# Altium project simController.PrjPcb
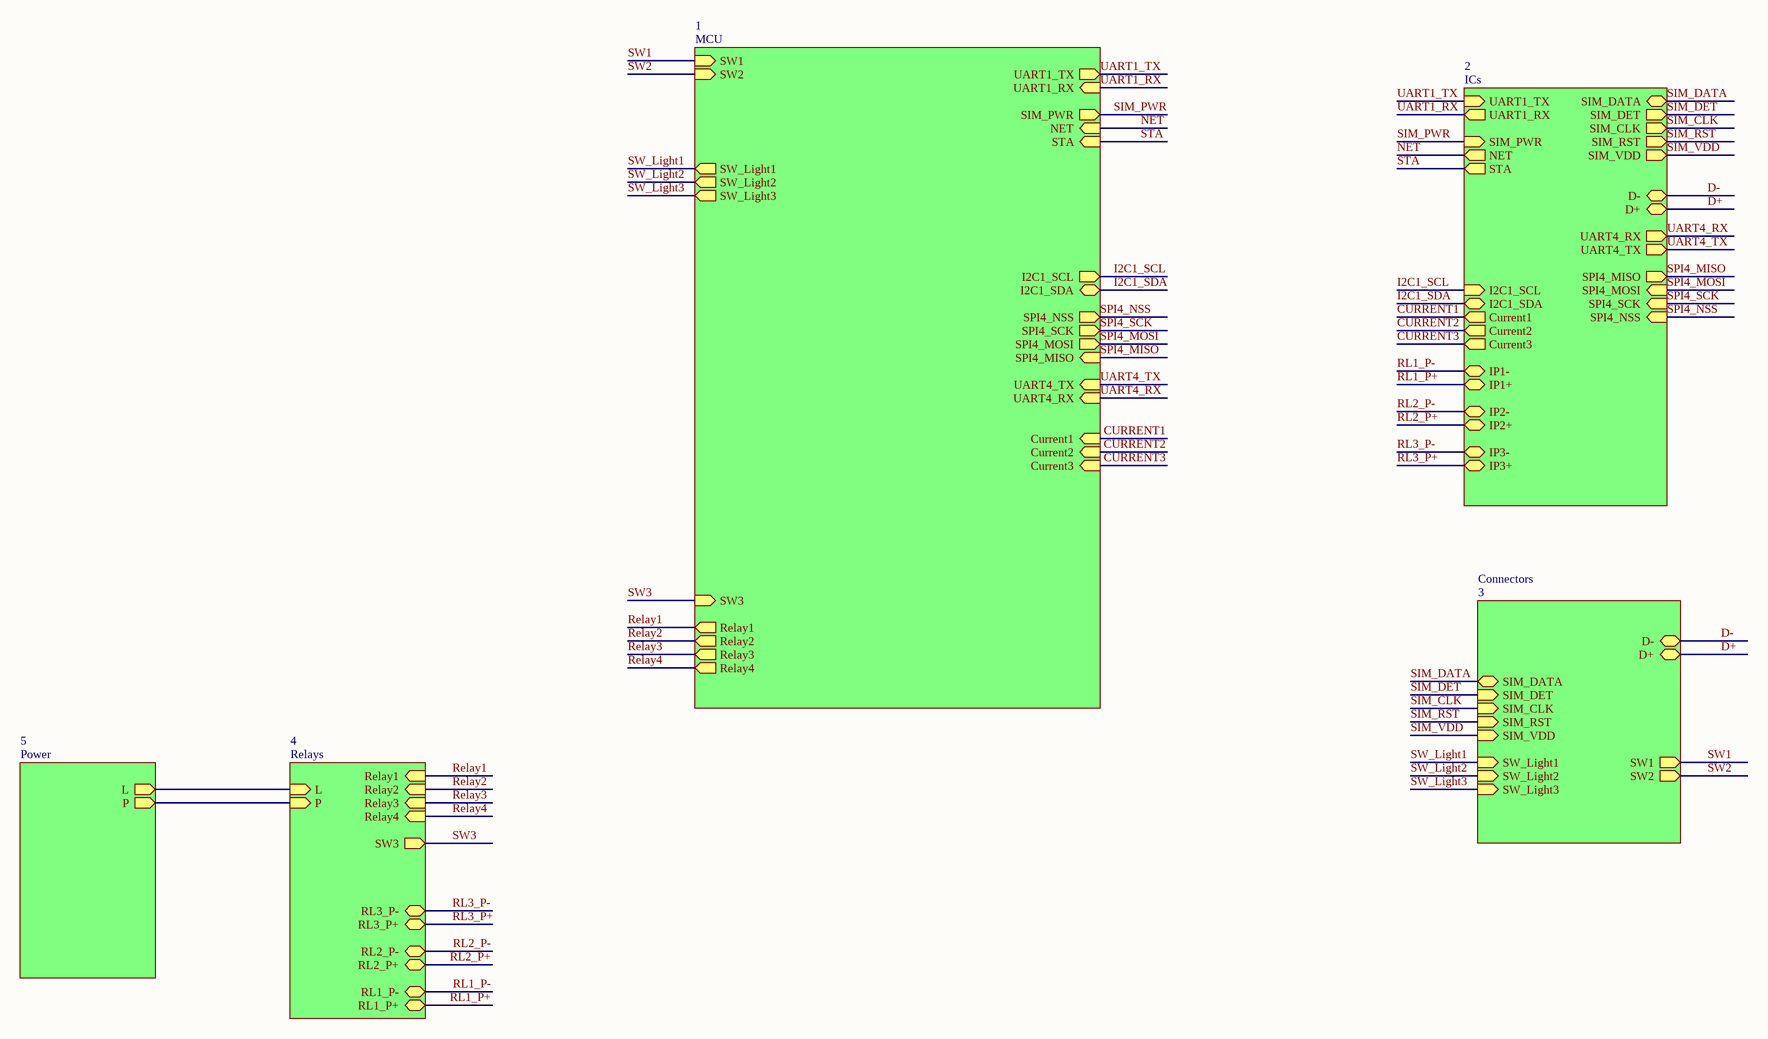
[diagram p0: Main.SchDoc]
6 sheets, 165 parts. Net scope: hierarchical (ports join the sheet entries above them; power ports are global).
Board file: SIM_Cntroller_P200.PcbDoc
Sheets:
  Main.SchDoc
    1 = MCU.SchDoc
    4 = Relays.SchDoc
    3 = Connectors.SchDoc
    5 = Power.SchDoc
    2 = ICs.SchDoc

## Sheet Main.SchDoc
size A3

### Sub-sheets
1 = MCU: Relay1 (out), Relay2 (out), UART4_RX (in), UART1_TX (out), UART1_RX (in), SIM_PWR (out), NET (in), STA (in), I2C1_SCL (out), I2C1_SDA (bidir), SPI4_NSS (out), SPI4_SCK (out), SPI4_MOSI (out), SPI4_MISO (in), SW1 (in), SW2 (in), SW_Light1 (out), SW_Light2 (out), Current1 (in), Current2 (in), SW_Light3 (out), UART4_TX (in), Relay3 (out), Relay4 (out), SW3 (in), Current3 (in)
2 = ICs: STA (out), NET (out), SIM_PWR (in), UART1_RX (out), UART1_TX (in), I2C1_SCL (in), I2C1_SDA (bidir), SPI4_NSS (in), SPI4_SCK (in), SPI4_MOSI (in), SPI4_MISO (out), UART4_RX (out), D+ (bidir), D- (bidir), SIM_CLK (out), SIM_DATA (bidir), SIM_DET (out), SIM_RST (out), SIM_VDD (out), IP2- (bidir), IP2+ (bidir), IP1- (bidir), IP1+ (bidir), Current1 (out), Current2 (out), UART4_TX (out), IP3- (bidir), IP3+ (bidir), Current3 (out)
3 = Connectors: SW_Light1 (in), SW_Light2 (in), D- (bidir), D+ (bidir), SW1 (out), SW2 (out), SIM_DATA (bidir), SIM_DET (in), SIM_CLK (in), SIM_RST (in), SIM_VDD (in), SW_Light3 (in)
4 = Relays: Relay1 (in), Relay2 (in), L (in), P (in), RL1_P- (bidir), RL1_P+ (bidir), RL2_P- (bidir), RL2_P+ (bidir), Relay3 (in), RL3_P+ (bidir), Relay4 (in), RL3_P- (bidir), SW3 (out)
5 = Power: L (out), P (out)

### Nets
CURRENT1: sheet 1/Current1, sheet 2/Current1
CURRENT2: sheet 1/Current2, sheet 2/Current2
CURRENT3: sheet 1/Current3, sheet 2/Current3
D+: sheet 3/D+, sheet 2/D+
D-: sheet 3/D-, sheet 2/D-
I2C1_SCL: sheet 1/I2C1_SCL, sheet 2/I2C1_SCL
I2C1_SDA: sheet 1/I2C1_SDA, sheet 2/I2C1_SDA
L: sheet 4/L, sheet 5/L
NET: sheet 1/NET, sheet 2/NET
P: sheet 4/P, sheet 5/P
Relay1: sheet 1/Relay1, sheet 4/Relay1
Relay2: sheet 1/Relay2, sheet 4/Relay2
Relay3: sheet 1/Relay3, sheet 4/Relay3
Relay4: sheet 1/Relay4, sheet 4/Relay4
RL1_P+: sheet 4/RL1_P+, sheet 2/IP1+
RL1_P-: sheet 4/RL1_P-, sheet 2/IP1-
RL2_P+: sheet 4/RL2_P+, sheet 2/IP2+
RL2_P-: sheet 4/RL2_P-, sheet 2/IP2-
RL3_P+: sheet 4/RL3_P+, sheet 2/IP3+
RL3_P-: sheet 4/RL3_P-, sheet 2/IP3-
SIM_CLK: sheet 3/SIM_CLK, sheet 2/SIM_CLK
SIM_DATA: sheet 3/SIM_DATA, sheet 2/SIM_DATA
SIM_DET: sheet 3/SIM_DET, sheet 2/SIM_DET
SIM_PWR: sheet 1/SIM_PWR, sheet 2/SIM_PWR  [project net PWRKEY]
SIM_RST: sheet 3/SIM_RST, sheet 2/SIM_RST
SIM_VDD: sheet 3/SIM_VDD, sheet 2/SIM_VDD
SPI4_MISO: sheet 1/SPI4_MISO, sheet 2/SPI4_MISO
SPI4_MOSI: sheet 1/SPI4_MOSI, sheet 2/SPI4_MOSI
SPI4_NSS: sheet 1/SPI4_NSS, sheet 2/SPI4_NSS
SPI4_SCK: sheet 1/SPI4_SCK, sheet 2/SPI4_SCK
STA: sheet 1/STA, sheet 2/STA
SW1: sheet 1/SW1, sheet 3/SW1
SW2: sheet 1/SW2, sheet 3/SW2
SW3: sheet 1/SW3, sheet 4/SW3
SW_Light1: sheet 1/SW_Light1, sheet 3/SW_Light1
SW_Light2: sheet 1/SW_Light2, sheet 3/SW_Light2
SW_Light3: sheet 1/SW_Light3, sheet 3/SW_Light3
UART1_RX: sheet 1/UART1_RX, sheet 2/UART1_RX  [project net sim800_tx]
UART1_TX: sheet 1/UART1_TX, sheet 2/UART1_TX  [project net sim800_rx]
UART4_RX: sheet 1/UART4_RX, sheet 2/UART4_RX  [project net ESP_RXD]
UART4_TX: sheet 1/UART4_TX, sheet 2/UART4_TX  [project net ESP_TXD]

## Sheet MCU.SchDoc
size A3
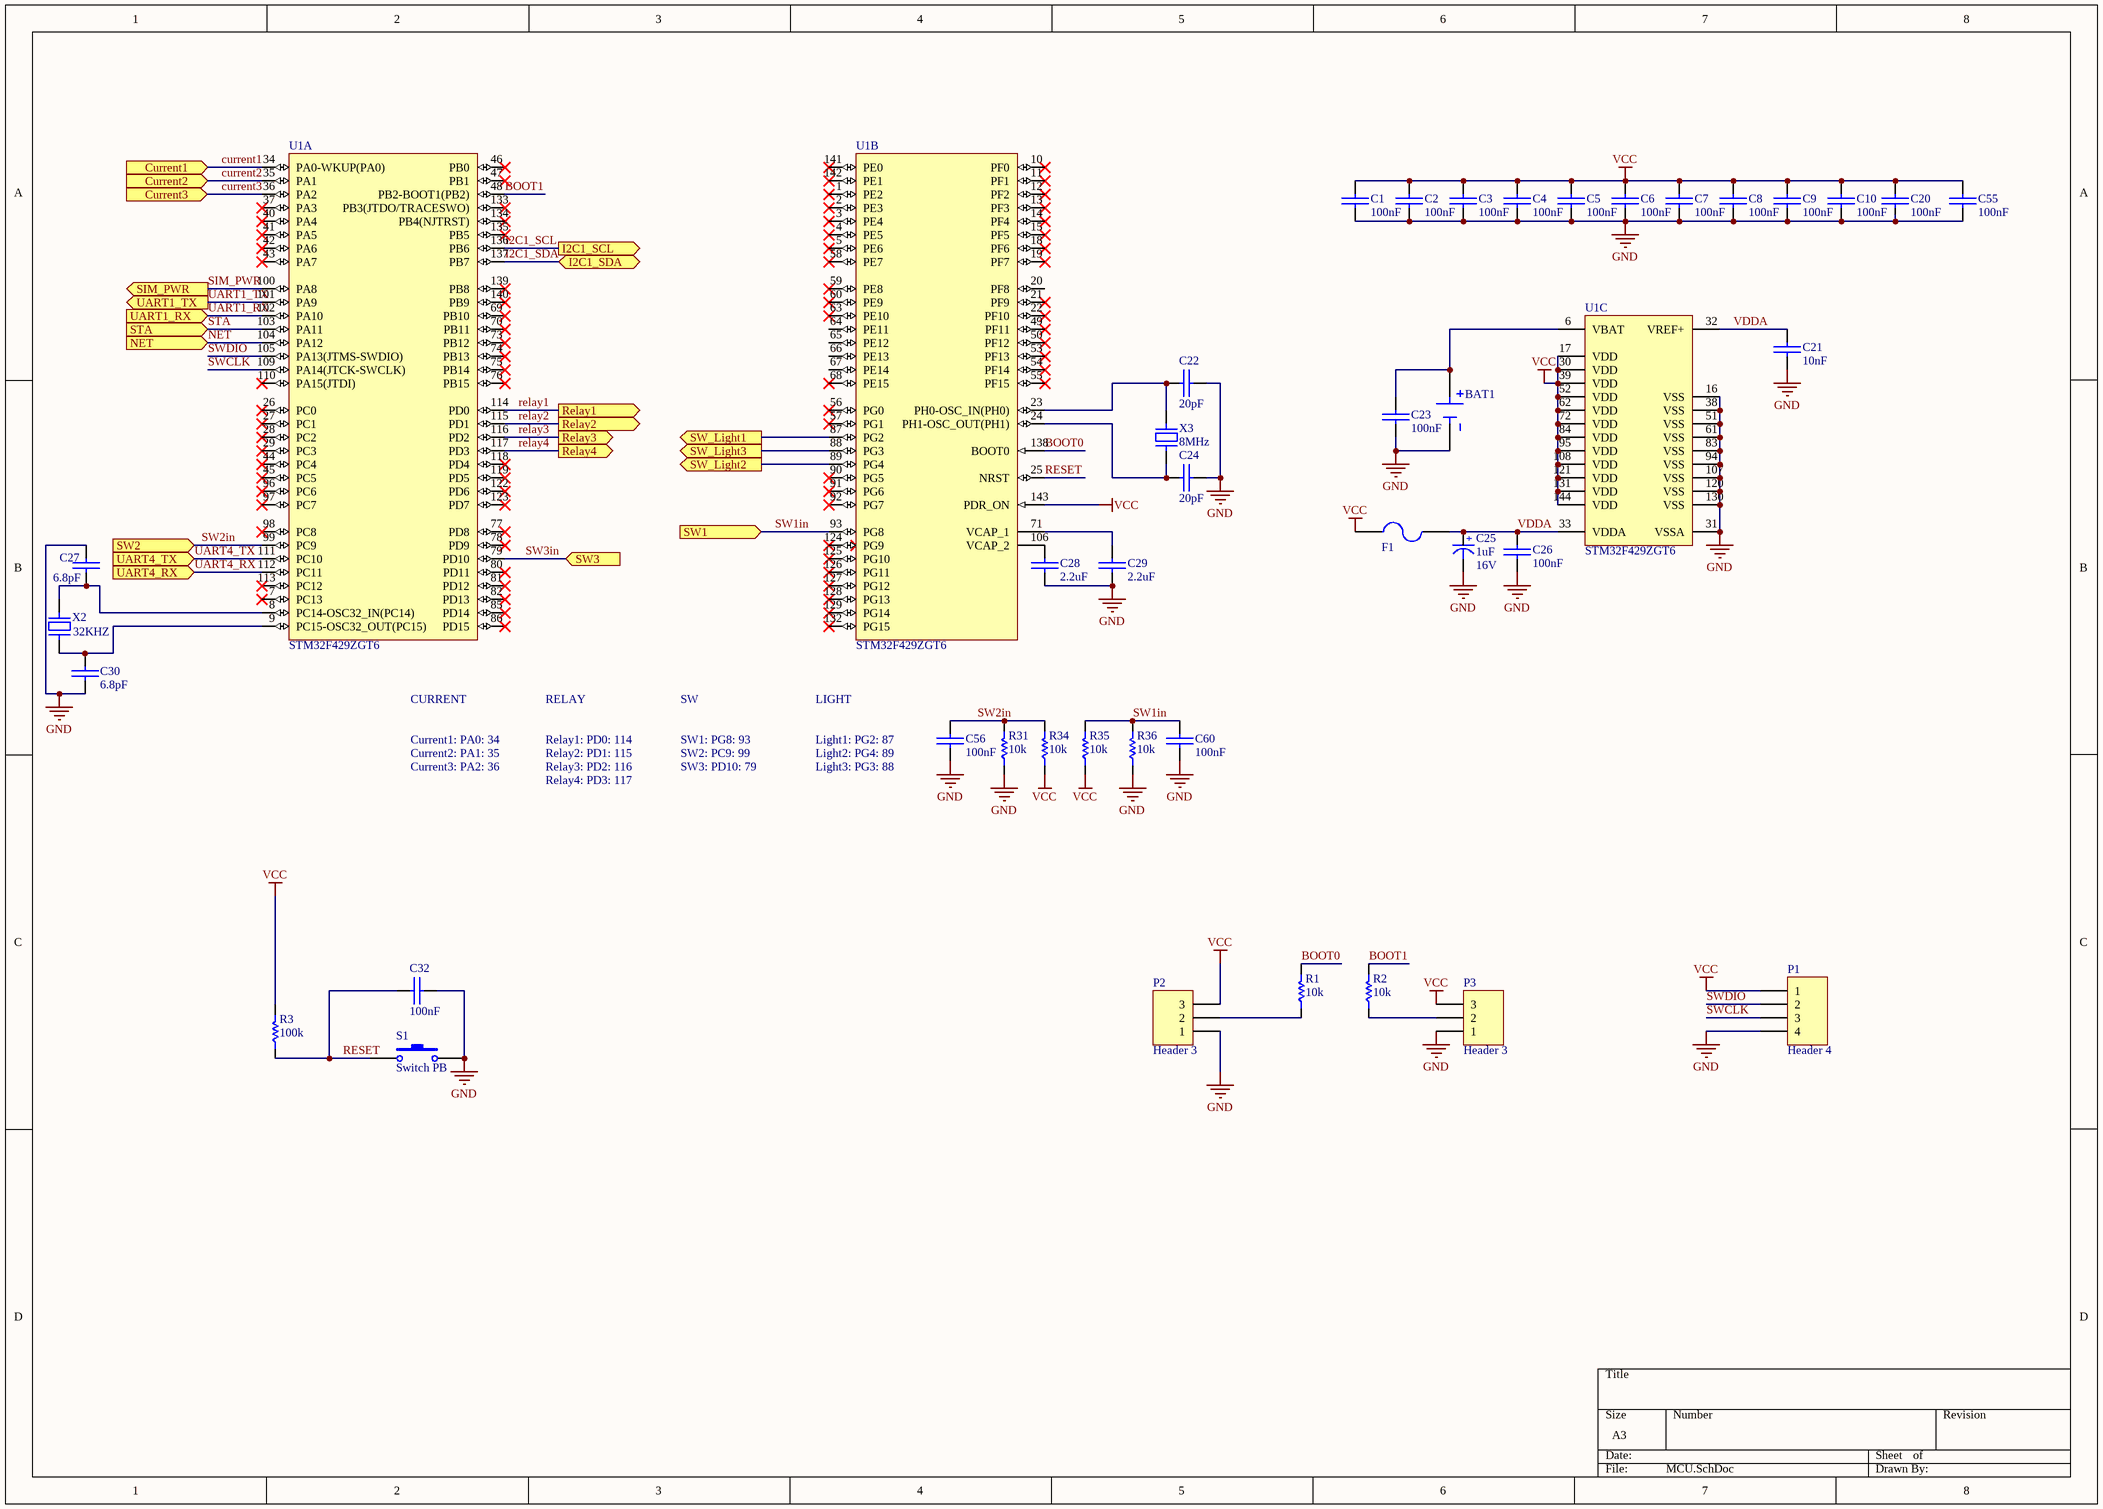
[diagram p1: MCU.SchDoc]

### Parts
BAT1  BAT  [BAT_STAND]  (value not drawn)
C1  100nF  [CAP 0603_1608]
C2  100nF  [CAP 0603_1608]
C3  100nF  [CAP 0603_1608]
C4  100nF  [CAP 0603_1608]
C5  100nF  [CAP 0603_1608]
C6  100nF  [CAP 0603_1608]
C7  100nF  [CAP 0603_1608]
C8  100nF  [CAP 0603_1608]
C9  100nF  [CAP 0603_1608]
C10  100nF  [CAP 0603_1608]
C20  100nF  [CAP 0603_1608]
C21  10nF  [CAP 0603_1608]
C22  20pF  [CAP 0805_2012]
C23  100nF  [CAP 0603_1608]
C24  20pF  [CAP 0805_2012]
C25  Voltage: 16V  [CAPP 1206 (3216X18L) Size A]  (hidden comment: 1uF)
C26  100nF  [CAP 0603_1608]
C27  6.8pF  [CAP 0805_2012]
C28  2.2uF  [CAP 0805_2012]
C29  2.2uF  [CAP 0805_2012]
C30  6.8pF  [CAP 0805_2012]
C32  100nF  [CAP 0603_1608]
C55  100nF  [CAP 0603_1608]
C56  100nF  [CAP 0805_2012]
C60  100nF  [CAP 0805_2012]
F1  Ferrite Bead  [FUSE_0805]  (value not drawn)
P1  Header 4  [HDR1X4]
P2  Header 3  [HDR1X3]
P3  Header 3  [HDR1X3]
R1  10k  [RES 0805_2012]
R2  10k  [RES 0805_2012]
R3  100k  [RES 0805_2012]
R31  10k  [RES 0805_2012]
R34  10k  [RES 0805_2012]
R35  10k  [RES 0805_2012]
R36  10k  [RES 0805_2012]
S1  Switch PB  [Switch - Push to On]
U1  STM32F429ZGT6  [LQFP144]  (parts A,B,C of 3)
X2  32KHZ  [IND 1206_3216]
X3  Parameter 1: 8MHz  [XTAL THD HC49]

### Ports
Current1 (in), Current2 (in), Current3 (in), I2C1_SCL (out), I2C1_SDA (bidir), NET (in), Relay1 (out), Relay2 (out), Relay3 (out), Relay4 (out), SIM_PWR (out), STA (in), SW1 (in), SW2 (in), SW3 (in), SW_Light1 (out), SW_Light2 (out), SW_Light3 (out), UART1_RX (in), UART1_TX (out), UART4_RX (in), UART4_TX (in)

### Nets
GND: BAT1.NEG C1.1(+) C2.1(+) C3.1(+) C4.1(+) C5.1(+) C6.1(+) C7.1(+) C8.1(+) C9.1(+) C10.1(+) C20.1(+) C21.1(+) C22.1(+) C23.1(+) C24.1(+) C25.2(-) C26.1(+) C27.1(+) C28.1(+) C29.1(+) C30.2(-) C32.1(+) C55.1(+) C56.1(+) C60.1(+) P1.4 P2.1 P3.1 R31.1 R36.1 S1.2 U1.16(VSS) U1.31(VSSA) U1.38(VSS) U1.51(VSS) U1.61(VSS) U1.83(VSS) U1.94(VSS) U1.107(VSS) U1.120(VSS) U1.130(VSS)
VCC: C1.2(-) C2.2(-) C3.2(-) C4.2(-) C5.2(-) C6.2(-) C7.2(-) C8.2(-) C9.2(-) C10.2(-) C20.2(-) C55.2(-) F1.1 P1.1 P2.3 P3.3 R3.2 R34.1 R35.1 U1.17(VDD) U1.30(VDD) U1.39(VDD) U1.52(VDD) U1.62(VDD) U1.72(VDD) U1.84(VDD) U1.95(VDD) U1.108(VDD) U1.121(VDD) U1.131(VDD) U1.143(PDR_ON) U1.144(VDD)
BOOT0: R1.2 U1.138(BOOT0)
BOOT1: R2.2 U1.48(PB2-BOOT1(PB2))
CURRENT1: U1.34(PA0-WKUP(PA0)) ; port Current1
CURRENT2: U1.35(PA1) ; port Current2
CURRENT3: U1.36(PA2) ; port Current3
I2C1_SCL: U1.136(PB6) ; port I2C1_SCL
I2C1_SDA: U1.137(PB7) ; port I2C1_SDA
NET: U1.104(PA12) ; port NET
Relay1: U1.114(PD0) ; port Relay1
Relay2: U1.115(PD1) ; port Relay2
Relay3: U1.116(PD2) ; port Relay3
Relay4: U1.117(PD3) ; port Relay4
RESET: C32.2(-) R3.1 S1.1 U1.25(NRST)
SIM_PWR: U1.100(PA8) ; port SIM_PWR  [project net PWRKEY]
STA: U1.103(PA11) ; port STA
SW1in: C60.2(-) R35.2 R36.2 U1.93(PG8) ; port SW1  [project net SW1]
SW2in: C56.2(-) R31.2 R34.2 U1.99(PC9) ; port SW2  [project net SW2]
SW3in: U1.79(PD10) ; port SW3  [project net SW3]
SW_Light1: U1.87(PG2) ; port SW_Light1
SW_Light2: U1.89(PG4) ; port SW_Light2
SW_Light3: U1.88(PG3) ; port SW_Light3
SWCLK: P1.3 U1.109(PA14(JTCK-SWCLK))
SWDIO: P1.2 U1.105(PA13(JTMS-SWDIO))
UART1_RX: U1.102(PA10) ; port UART1_RX  [project net sim800_tx]
UART1_TX: U1.101(PA9) ; port UART1_TX  [project net sim800_rx]
UART4_RX: U1.112(PC11) ; port UART4_RX  [project net ESP_RXD]
UART4_TX: U1.111(PC10) ; port UART4_TX  [project net ESP_TXD]
VDDA: C21.2(-) C25.1(+) C26.2(-) F1.2 U1.32(VREF+) U1.33(VDDA)
NetBAT1_S+1: BAT1.S+1(POS) BAT1.S+2(POS) C23.2(-) U1.6(VBAT)
NetC22_2: C22.2(-) U1.23(PH0-OSC_IN(PH0)) X3.2
NetC24_2: C24.2(-) U1.24(PH1-OSC_OUT(PH1)) X3.1
NetC27_2: C27.2(-) U1.8(PC14-OSC32_IN(PC14)) X2.2
NetC28_2: C28.2(-) U1.106(VCAP_2)
NetC29_2: C29.2(-) U1.71(VCAP_1)
NetC30_1: C30.1(+) U1.9(PC15-OSC32_OUT(PC15)) X2.1
NetP2_2: P2.2 R1.1
NetP3_2: P3.2 R2.1

Not connected (* = marked no-connect by the designer): U1 1(PE2)* 2(PE3)* 3(PE4)* 4(PE5)* 5(PE6)* 7(PC13)* 10(PF0)* 11(PF1)* 12(PF2)* 13(PF3)* 14(PF4)* 15(PF5)* 18(PF6)* 19(PF7)* 20(PF8) 21(PF9)* 22(PF10)* 26(PC0)* 27(PC1)* 28(PC2)* 29(PC3)* 37(PA3)* 40(PA4)* 41(PA5)* 42(PA6)* 43(PA7)* 44(PC4)* 45(PC5)* 46(PB0)* 47(PB1)* 49(PF11)* 50(PF12)* 53(PF13)* 54(PF14)* 55(PF15)* 56(PG0)* 57(PG1)* 58(PE7)* 59(PE8)* 60(PE9)* 63(PE10)* 64(PE11) 65(PE12) 66(PE13) 67(PE14) 68(PE15)* 69(PB10)* 70(PB11)* 73(PB12)* 74(PB13)* 75(PB14)* 76(PB15)* 77(PD8)* 78(PD9)* 80(PD11)* 81(PD12)* 82(PD13)* 85(PD14)* 86(PD15)* 90(PG5)* 91(PG6)* 92(PG7)* 96(PC6)* 97(PC7)* 98(PC8)* 110(PA15(JTDI))* 113(PC12)* 118(PD4)* 119(PD5)* 122(PD6)* 123(PD7)* 124(PG9)* 125(PG10)* 126(PG11)* 127(PG12)* 128(PG13)* 129(PG14)* 132(PG15)* 133(PB3(JTDO/TRACESWO))* 134(PB4(NJTRST))* 135(PB5)* 139(PB8)* 140(PB9)* 141(PE0)* 142(PE1)*

### Notes on the sheet
- CURRENT
- RELAY
- SW
- LIGHT
- Current1: PA0: 34
- Current2: PA1: 35
- Current3: PA2: 36
- Relay1: PD0: 114
- Relay2: PD1: 115
- Relay3: PD2: 116
- Relay4: PD3: 117
- SW3: PD10: 79
- SW1: PG8: 93
- SW2: PC9: 99
- (near C56) Light2: PG4: 89
- (near C56) Light3: PG3: 88
- (near C56) Light1: PG2: 87

### Library data of the parts
BAT1 = BAT: BATTERY HOLDER COIN
C1-C10 C20-C24 C26-C30 C32 C55 C56 C60 = Cap-Bipolar: Bipolar Capacitor; Voltage: 100V; Designer: Saeid Jorablo; Organazation: ControTec; Adding Date: 1387/12/20
  C1-C10 C20 C23 C26 C32 C55 C56 C60: Value: 100nF
  C21: Value: 10nF
  C22 C24: Value: 20pF
  C27 C30: Value: 6.8pF
  C28 C29: Value: 2.2uF
C25 = Cap-Polar: Polar Capacitor; Designer: Saeid Jorablo; Organazation: ControTec; Adding Date: 1387/12/20; Value: 1uF
F1 = Fuse 0805: Value: Ferrite Bead
P1 = Header 4: Header, 4-Pin; LatestRevisionDate: 17-Jul-2002; LatestRevisionNote: Re-released for DXP Platform.; Publisher: Altium Limited
P2 P3 = Header 3: Header, 3-Pin; LatestRevisionDate: 17-Jul-2002; LatestRevisionNote: Re-released for DXP Platform.; Publisher: Altium Limited
R1-R3 R31 R34-R36 = Resistor
  R1 R2 R31 R34-R36: Value: 10k
  R3: Value: 100k
S1 = Switch PB: Push Button Switch
U1 = STM32F429ZGT6: ARM Cortex-M4 32-bit MCU+FPU, 225 DMIPS, 1024 kB Flash, 256 kB Internal RAM, 114 I/Os, 144-pin LQFP, -40 to 85 degC, Tray; Manufacturer: STMicroelectronics; D/A Converter: 2x12-bit; FLASH Size (Prog) (kB): 1024; I/Os (High Current): 114; Internal RAM Size (kB): 256; Operating Frequency(F) (Processor speed) (MHz): 180; Supply Voltage(Vcc) max (V): 3.6; Supply Voltage(Vcc) min (V): 1.8; DatasheetVersion: Rev. 2; PackageVersion: Rev. 4, 06/2013; PackageReference: LQFP144; PackageDescription: 144-Pin Low Profile Quad Flat Package, 20 x 20 mm Body, 0.5 mm Pitch; Core: ARM Cortex-M4; Packing: Tray; Mounting Technology: Surface Mount; PartNumber: STM32F429ZGT6; ComponentLink1Description: Manufacturer URL; ComponentLink1URL: http://www.st.com/web/en/home.html; ComponentLink2Description: Datasheet; ComponentLink2URL: http://www.st.com/st-web-ui/static/active/en/resource/technical/document/data_brief/DM00053488.pdf; ComponentLink3Description: Package Specification; ComponentLink3URL: http://www.st.com/st-web-ui/static/active/en/resource/technical/document/datasheet/DM00037051.pdf
X2 = Crystal HC-49S SMD: SMT Crystal; VALUE: 32KHZ
X3 = Crystal THD HC49: SMT Crystal

## Sheet Relays.SchDoc
size A3
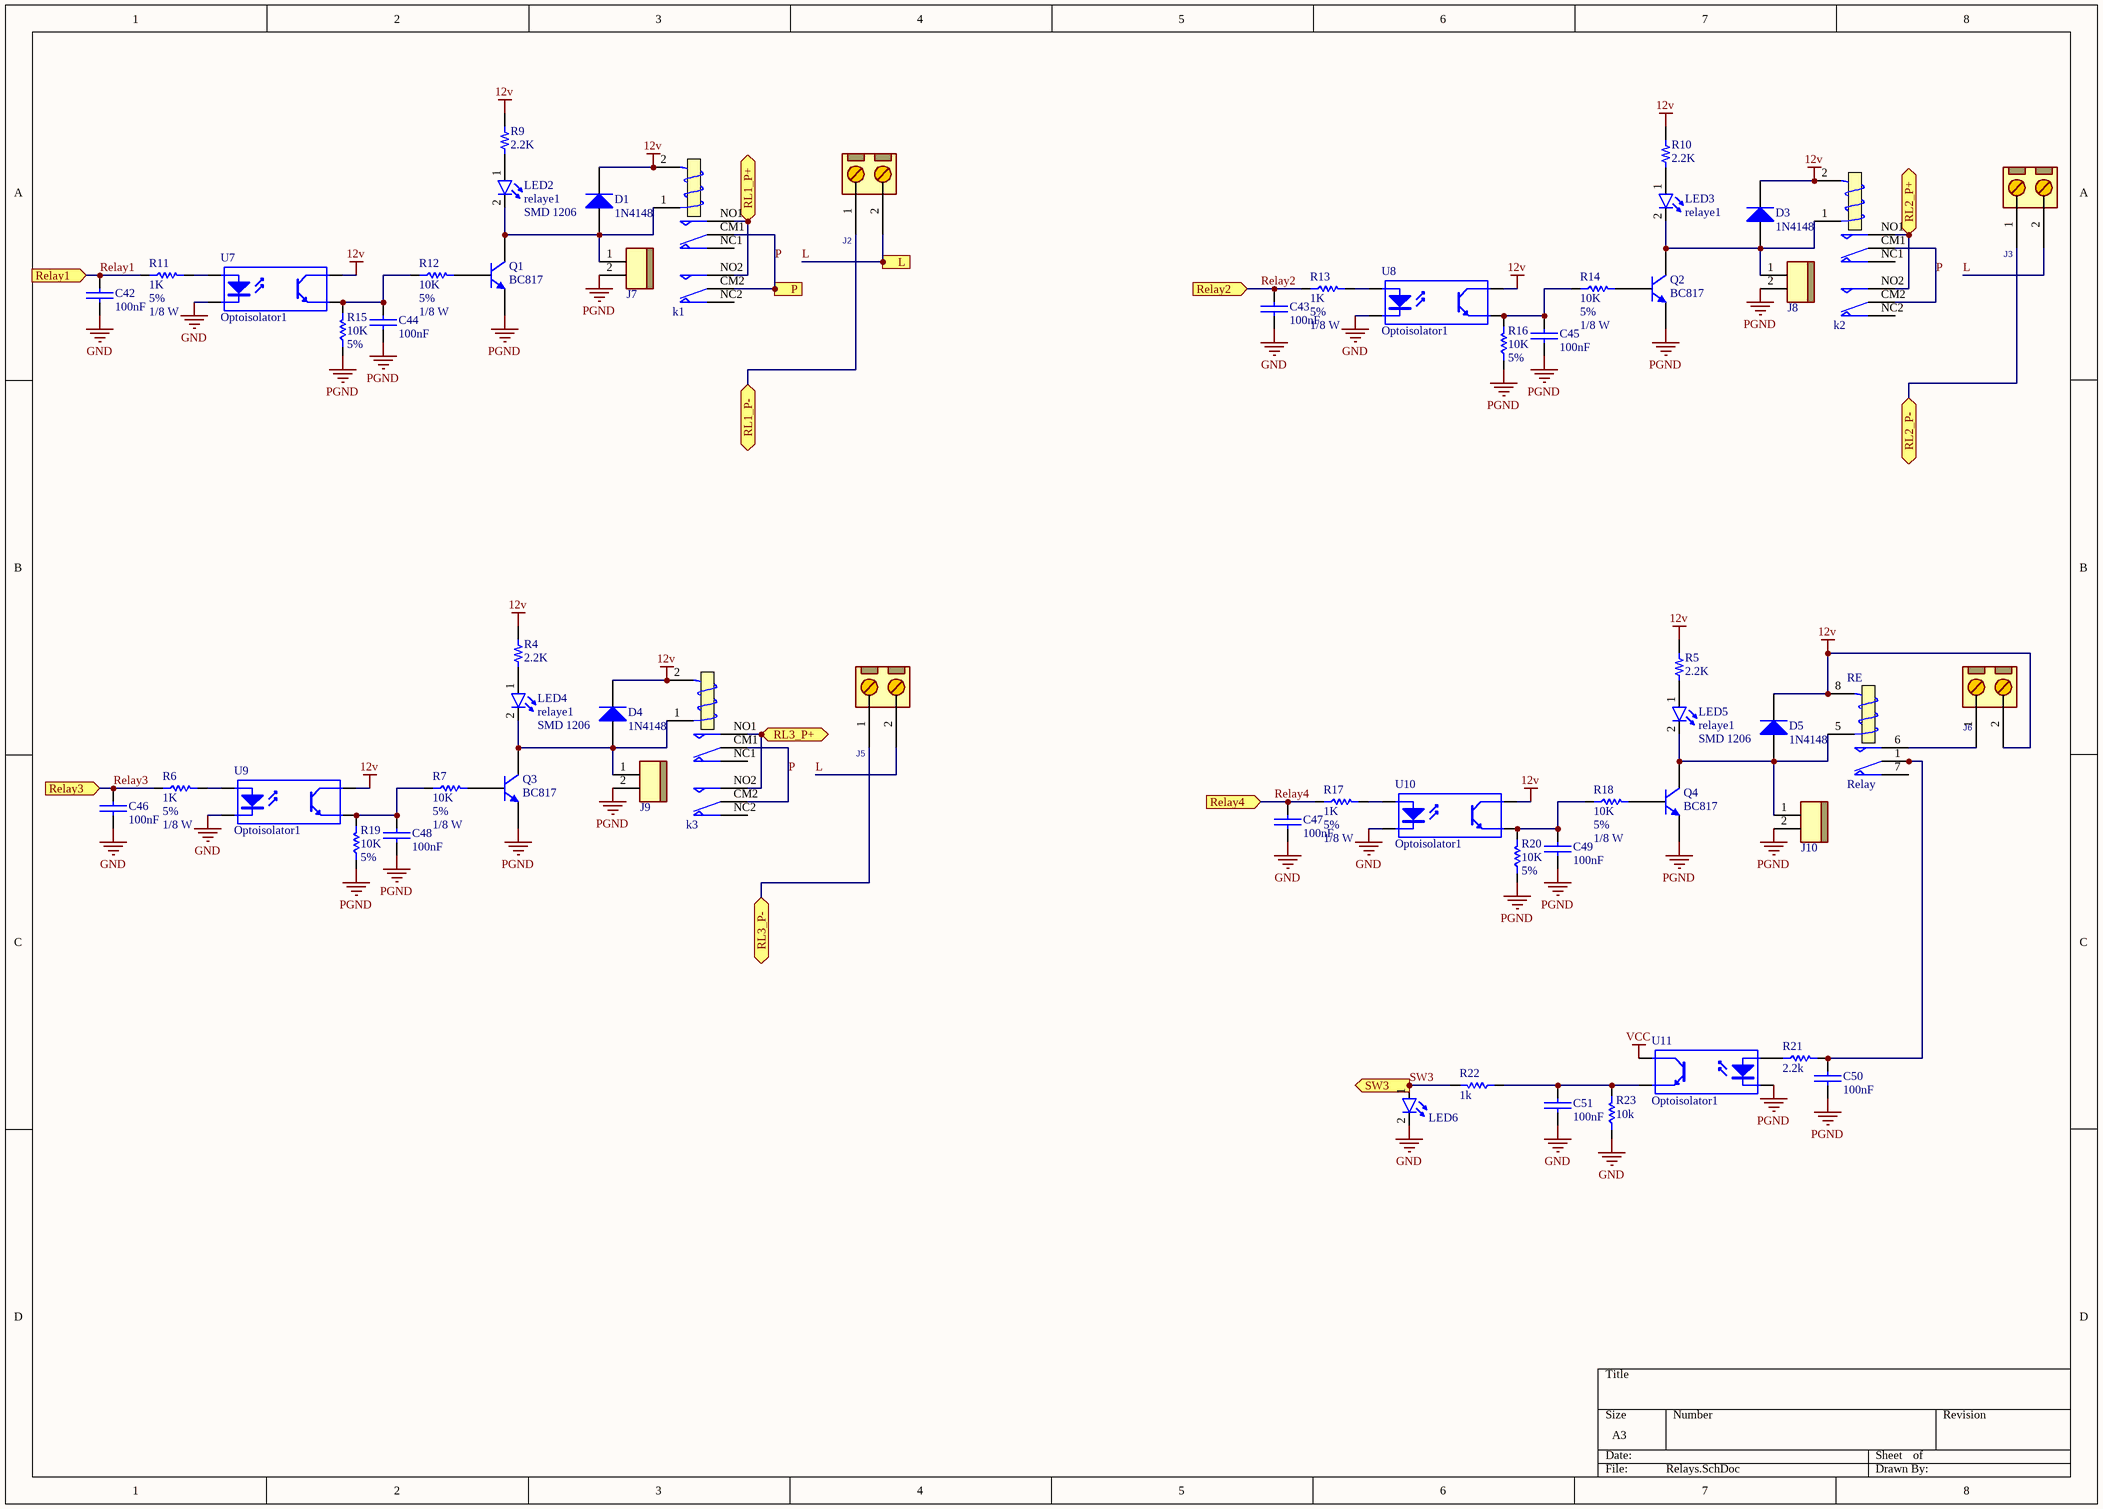
[diagram p2: Relays.SchDoc]

### Parts
C42  100nF  [CAP 0805_2012]
C43  100nF  [CAP 0805_2012]
C44  100nF  [CAP 0805_2012]
C45  100nF  [CAP 0805_2012]
C46  100nF  [CAP 0805_2012]
C47  100nF  [CAP 0805_2012]
C48  100nF  [CAP 0805_2012]
C49  100nF  [CAP 0805_2012]
C50  100nF  [CAP 0805_2012]
C51  100nF  [CAP 0805_2012]
D1  1N4148  [LL4148]
D3  1N4148  [LL4148]
D4  1N4148  [LL4148]
D5  1N4148  [LL4148]
J2  CONN_TB2  [P_TBB_2]  (value not drawn)
J3  CONN_TB2  [P_TBB_2]  (value not drawn)
J5  CONN_TB2  [P_TBB_2]  (value not drawn)
J6  CONN_TB2  [P_TBB_2]  (value not drawn)
J7  JST BxB-PH-K 2Pin  [JST B2B-PH-K]  (value not drawn)
J8  JST BxB-PH-K 2Pin  [JST B2B-PH-K]  (value not drawn)
J9  JST BxB-PH-K 2Pin  [JST B2B-PH-K]  (value not drawn)
J10  JST BxB-PH-K 2Pin  [JST B2B-PH-K]  (value not drawn)
k1  Relay_8PIN_OMRON  [Relay_8]  (value not drawn)
k2  Relay_8PIN_OMRON  [Relay_8]  (value not drawn)
k3  Relay_8PIN_OMRON  [Relay_8]  (value not drawn)
LED2  power: relaye1  Size: SMD 1206  [LED SMD 1206]
LED3  power: relaye1  [LED SMD 1206]
LED4  power: relaye1  Size: SMD 1206  [LED SMD 1206]
LED5  power: relaye1  Size: SMD 1206  [LED SMD 1206]
LED6  (no value)  [LED_1206_GREEN]
Q1  BC817  [SOT23_BEC_M]
Q2  BC817  [SOT23_BEC_M]
Q3  BC817  [SOT23_BEC_M]
Q4  BC817  [SOT23_BEC_M]
R4  2.2K  [RES 0805_2012]
R5  2.2K  [RES 0805_2012]
R6  Tolerance: 5%  Power: 1/8 W  [RES 0805_2012]  (hidden comment: 1K)
R7  Tolerance: 5%  Power: 1/8 W  [RES 0805_2012]  (hidden comment: 10K)
R9  2.2K  [RES 0805_2012]
R10  2.2K  [RES 0805_2012]
R11  Tolerance: 5%  Power: 1/8 W  [RES 0805_2012]  (hidden comment: 1K)
R12  Tolerance: 5%  Power: 1/8 W  [RES 0805_2012]  (hidden comment: 10K)
R13  Tolerance: 5%  Power: 1/8 W  [RES 0805_2012]  (hidden comment: 1K)
R14  Tolerance: 5%  Power: 1/8 W  [RES 0805_2012]  (hidden comment: 10K)
R15  Tolerance: 5%  [RES 0805_2012]  (hidden comment: 10K)
R16  Tolerance: 5%  [RES 0805_2012]  (hidden comment: 10K)
R17  Tolerance: 5%  Power: 1/8 W  [RES 0805_2012]  (hidden comment: 1K)
R18  Tolerance: 5%  Power: 1/8 W  [RES 0805_2012]  (hidden comment: 10K)
R19  Tolerance: 5%  [RES 0805_2012]  (hidden comment: 10K)
R20  Tolerance: 5%  [RES 0805_2012]  (hidden comment: 10K)
R21  2.2k  [RES 0805_2012]
R22  1k  [RES 0805_2012]
R23  10k  [RES 0805_2012]
RE  Relay  [Through-hole 6PIN]
U7  Optoisolator1  [DIP-4]
U8  Optoisolator1  [DIP-4]
U9  Optoisolator1  [DIP-4]
U10  Optoisolator1  [DIP-4]
U11  Optoisolator1  [DIP-4]

### Ports
L (in), P (in), Relay1 (in), Relay2 (in), Relay3 (in), Relay4 (in), RL1_P+ (bidir), RL1_P- (bidir), RL2_P+ (bidir), RL2_P- (bidir), RL3_P+ (bidir), RL3_P- (bidir), SW3 (out)

### Nets
12v: D1.2(K) D3.2(K) D4.2(K) D5.2(K) J6.2 k1.2(T2) k2.2(T2) k3.2(T2) R4.2 R5.2 R9.2 R10.2 RE.8(T2) U7.4(C) U8.4(C) U9.4(C) U10.4(C)
GND: C42.1(+) C43.1(+) C44.1(+) C45.1(+) C46.1(+) C47.1(+) C48.1(+) C49.1(+) C50.1(+) C51.1(+) J7.2 J8.2 J9.2 J10.2 LED6.2(K) Q1.2(E) Q2.2(E) Q3.2(E) Q4.2(E) R15.1 R16.1 R19.1 R20.1 R23.1 U7.2(K) U8.2(K) U9.2(K) U10.2(K) U11.2(K)  [also labelled PGND]
VCC: U11.4(C)
L: J2.2 J3.2 J5.2 ; port L
P: k1.CM1(COM) k1.CM2(COM) k2.CM1(COM) k2.CM2(COM) k3.CM1(COM) k3.CM2(COM) ; port P
Relay1: C42.2(-) R11.1 ; port Relay1
Relay2: C43.2(-) R13.1 ; port Relay2
Relay3: C46.2(-) R6.1 ; port Relay3
Relay4: C47.2(-) R17.1 ; port Relay4
RL1_P+: k1.NO1(NO) k1.NO2(NO) ; port RL1_P+
RL1_P-: J2.1 ; port RL1_P-
RL2_P+: k2.NO1(NO) k2.NO2(NO) ; port RL2_P+
RL2_P-: J3.1 ; port RL2_P-
RL3_P+: k3.NO1(NO) k3.NO2(NO) ; port RL3_P+
RL3_P-: J5.1 ; port RL3_P-
SW3: LED6.1(A) R22.2 ; port SW3
NetC44_2: C44.2(-) R12.1 R15.2 U7.3(E)
NetC45_2: C45.2(-) R14.1 R16.2 U8.3(E)
NetC48_2: C48.2(-) R7.1 R19.2 U9.3(E)
NetC49_2: C49.2(-) R18.1 R20.2 U10.3(E)
NetC50_2: C50.2(-) R21.2 RE.1(COM) RE.12(COM)
NetC51_2: C51.2(-) R22.1 R23.2 U11.3(E)
NetD1_1: D1.1(A) J7.1 k1.1(T1) LED2.2(K) Q1.3(C)
NetD3_1: D3.1(A) J8.1 k2.1(T1) LED3.2(K) Q2.3(C)
NetD4_1: D4.1(A) J9.1 k3.1(T1) LED4.2(K) Q3.3(C)
NetD5_1: D5.1(A) J10.1 LED5.2(K) Q4.3(C) RE.5(T1)
NetJ6_1: J6.1 RE.6(NO)
NetLED2_1: LED2.1(A) R9.1
NetLED3_1: LED3.1(A) R10.1
NetLED4_1: LED4.1(A) R4.1
NetLED5_1: LED5.1(A) R5.1
NetQ1_1: Q1.1(B) R12.2
NetQ2_1: Q2.1(B) R14.2
NetQ3_1: Q3.1(B) R7.2
NetQ4_1: Q4.1(B) R18.2
NetR6_2: R6.2 U9.1(A)
NetR11_2: R11.2 U7.1(A)
NetR13_2: R13.2 U8.1(A)
NetR17_2: R17.2 U10.1(A)
NetR21_1: R21.1 U11.1(A)

Not connected (* = marked no-connect by the designer): k1 NC1(NC) NC2(NC); k2 NC1(NC) NC2(NC); k3 NC1(NC) NC2(NC); RE 7(NC)

### Library data of the parts
C42-C51 = Cap-Bipolar: as C1 on sheet MCU; Adding Date: 1387/12/20; Value: 100nF
D1 D3-D5 = Diode 1N4148: High Conductance Fast Diode; Published: 8-Jun-2000; LatestRevisionDate: 17-Jul-2002; LatestRevisionNote: Re-released for DXP Platform.; DatasheetVersion: 1997; PackageReference: DO-35; Publisher: Altium Limited; PackageDescription: Diode, Axial; Body 3.8 x 1.9 mm (LxDia. max), Lead Dia. 0.53 mm (max); Code_JEDEC: DO-204-AH; ComponentLink1Description: Manufacturer Link; ComponentLink1URL: http://www.fairchildsemi.com/; ComponentLink2Description: Datasheet; ComponentLink2URL: http://www.fairchildsemi.com/ds/1N%2F1N4148.pdf
J2 J3 J5 J6 = TB2 BLUE: CONN, TERMINAL BLOCK, 5.08mm pitch; VALUE: CONN_TB2
J7-J10 = JST BxB-PH-K 2Pin: Connector Header Through Hole 0.079" (2.00mm); PartNumber: B2B-PH-K-S(LF)(SN)
LED2-LED5 = LED: Designer: Saeid Jorablo; Organazation: ControTec; Adding Date: 1387/12/22
LED6 = LED: Designer: Saeid Jorablo; Organazation: ControTec; power: relaye1; Adding Date: 1387/12/22; Size: SMD 1206
Q1-Q4 = NPN: NPN Bipolar Transistor; Published: 8-Jun-2000; LatestRevisionDate: 29-May-2009; LatestRevisionNote: IPC-7351 Footprint Added.; PackageVersion: Aug-1999; PackageReference: SOT-23B; Publisher: Altium Limited; PackageDescription: 3-Pin SOT-23 Package 0.95 mm Pitch, 2.4 mm Lead Span
R4 R5 R9 R10 = Res SMD 0805: SMD Resistor; Value: 2.2K
R6 R7 R11-R20 = Resistor
  R6 R11 R13 R17: Value: 1K
  R7 R12 R14-R16 R18-R20: Value: 10K
R21-R23 = Resistor: Tolerance: 5%; Power: 1/8 W
  R21: Value: 2.2k
  R22: Value: 1k
  R23: Value: 10k
RE = RELAY 5V 3A: pin to pad: 12>1
U7-U11 = Optoisolator1: 4-Pin Phototransistor Optocoupler; Published: 24-Mar-1999; LatestRevisionDate: 04-Mar-2005; LatestRevisionNote: Sch pins 3 & 4 Swapped.; DatasheetVersion: Nov-2003; PackageReference: DIP-4; Publisher: Altium Limited

## Sheet Connectors.SchDoc
size A3
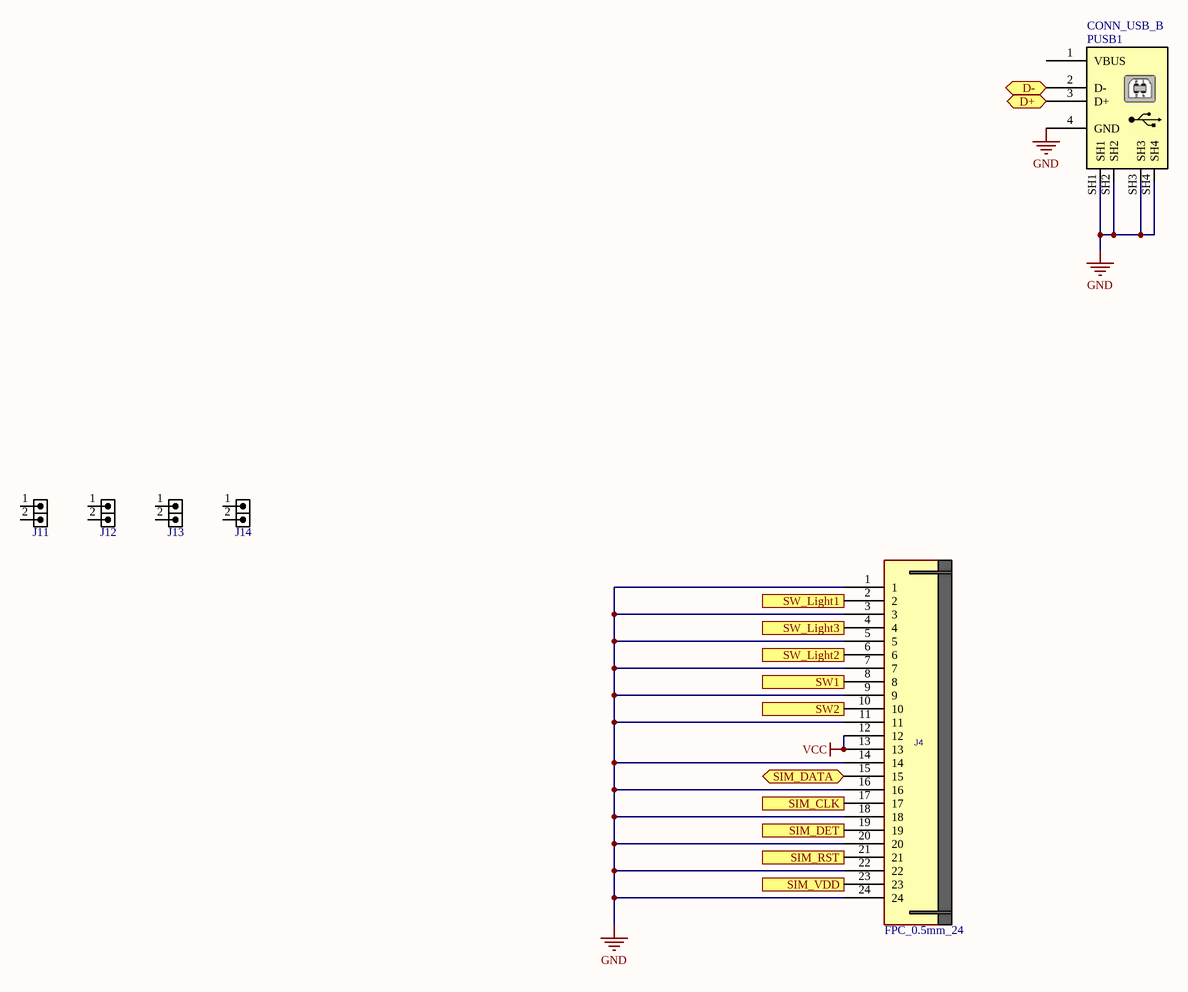
[diagram p3: Connectors.SchDoc]

### Parts
J4  FPC_0.5mm_24  [FPC50_24]
J11  HDRM2  [HDR_M_1X2]  (value not drawn)
J12  HDRM2  [HDR_M_1X2]  (value not drawn)
J13  HDRM2  [HDR_M_1X2]  (value not drawn)
J14  HDRM2  [HDR_M_1X2]  (value not drawn)
PUSB1  CONN_USB_B  [USB_B_ST]

### Ports
D+ (bidir), D- (bidir), SIM_CLK (in), SIM_DATA (bidir), SIM_DET (in), SIM_RST (in), SIM_VDD (in), SW1 (out), SW2 (out), SW_Light1 (in), SW_Light2 (in), SW_Light3 (in)

### Nets
GND: J4.1 J4.3 J4.5 J4.7 J4.9 J4.11 J4.14 J4.16 J4.18 J4.20 J4.22 J4.24 PUSB1.4(GND) PUSB1.SH1 PUSB1.SH2 PUSB1.SH3 PUSB1.SH4
VCC: J4.12 J4.13
D+: PUSB1.3(D+) ; port D+
D-: PUSB1.2(D-) ; port D-
SIM_CLK: J4.17 ; port SIM_CLK
SIM_DATA: J4.15 ; port SIM_DATA
SIM_DET: J4.19 ; port SIM_DET
SIM_RST: J4.21 ; port SIM_RST
SIM_VDD: J4.23 ; port SIM_VDD
SW1: J4.8 ; port SW1
SW2: J4.10 ; port SW2
SW_Light1: J4.2 ; port SW_Light1
SW_Light2: J4.6 ; port SW_Light2
SW_Light3: J4.4 ; port SW_Light3

Not connected (* = marked no-connect by the designer): J11 1 2; J12 1 2; J13 1 2; J14 1 2; PUSB1 1(VBUS)

### Library data of the parts
J4 = FPC50_24: CONN, FPC, 0.50mm pitch, RightAngle, Bot. Contact; DESC: FH12F-24S-0.5SH(55); MANF: MOLEX, Hirose, FCI; MANF_P#: 52437-2433, FH12-24S-0.5SH(55), SFV24R-1ST; VALUE: FPC_0.5mm_24
J11-J14 = HDR_M_1X2: CONN, HEADER, Male, pitch: 2.54mm, 2POS; VALUE: HDRM2
PUSB1 = USB_B_ST: CONN, USB, B, STRAIGHT, THD; MANF_P#: -; MANF: -; VALUE: CONN_USB_B

## Sheet Power.SchDoc
size A3
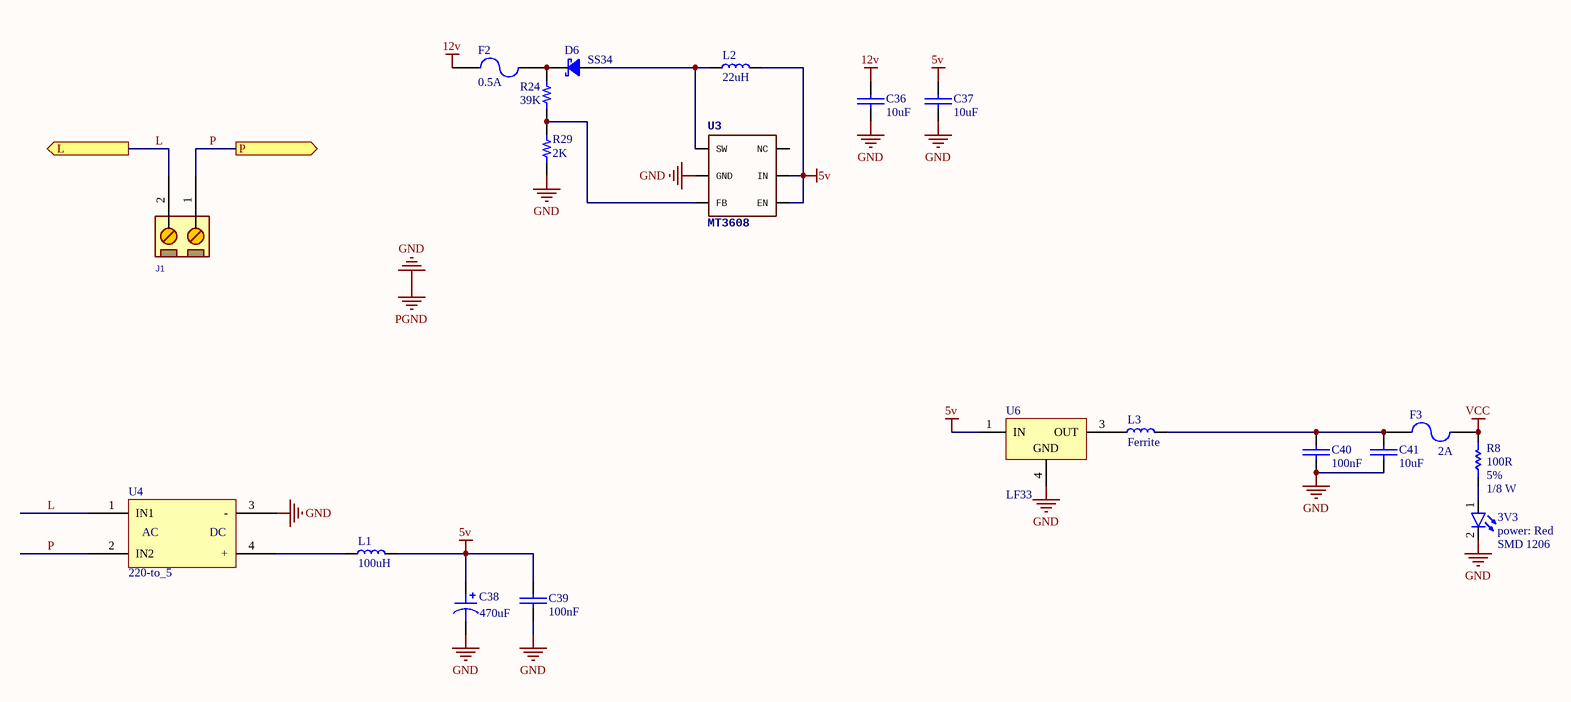
[diagram p4: Power.SchDoc]

### Parts
3V3  power: Red  Size: SMD 1206  [LED_1206_RED]
C36  10uF  [CAP 0603_1608]
C37  10uF  [CAP 0603_1608]
C38  470uF  [CAP TAN SMD 7343]
C39  100nF  [CAP 0603_1608]
C40  100nF  [CAP 0805_2012]
C41  10uF  [CAP 0805_2012]
D6  SS34  [DO-214AC SMA]
F2  value 0.5A  [FUSE_1206]  (hidden comment: Fuse 0805)
F3  value 2A  [FUSE_1206]  (hidden comment: Fuse 1206)
J1  CONN_TB2  [P_TBB_2]  (value not drawn)
L1  value 100uH  [IND 10X11MM]  (hidden comment: Inductor SMD POWER 10X11mm)
L2  value 22uH  [IND 5X5MM]  (hidden comment: Inductor SMD POWER 10X11mm)
L3  Ferrite  [IND 1206_3216]
R8  Tolerance: 5%  Power: 1/8 W  [RES 0805_2012]  (hidden comment: 100R)
R24  39K  [RES 0805_2012]
R29  2K  [RES 0805_2012]
U3  MT3608  [SOT-23-6 2.9X2.8MM P0.95MM]
U4  220-to_5  [HLK_5W]
U6  LF33  [TO252]

### Ports
L (out), P (out)

### Nets
5v: C37.2(-) C38.1 C39.2(-) L1.2 L2.2 U3.4(EN) U3.5(IN) U6.1(IN)
12v: C36.2(-) F2.1
GND: 3V3.2(K) C36.1(+) C37.1(+) C38.2 C39.1(+) C40.2(-) C41.2(-) R29.1 U3.2(GND) U4.3(-) U6.4(GND)  [also labelled PGND]
VCC: F3.2 R8.2
L: J1.2 U4.1(IN1) ; port L
P: J1.1 U4.2(IN2) ; port P
Net3V3_1: 3V3.1(A) R8.1
NetC40_1: C40.1(+) C41.1(+) F3.1 L3.2
NetD6_1: D6.1 L2.1 U3.1(SW)
NetD6_2: D6.2 F2.2 R24.2
NetL1_1: L1.1 U4.4(+)
NetL3_1: L3.1 U6.3(OUT)
NetR24_1: R24.1 R29.2 U3.3(FB)

Not connected (* = marked no-connect by the designer): U3 6(NC)

### Notes on the sheet
- (in symbol H-Link) AC; DC

### Library data of the parts
3V3 = LED: as LED2 on sheet Relays; Adding Date: 1387/12/22
C36 C37 C39-C41 = Cap-Bipolar: as C1 on sheet MCU; Adding Date: 1387/12/20
  C36 C37 C41: Value: 10uF
  C39 C40: Value: 100nF
C38 = Pol Cap SMD TAN 7343 SIZE D: SMT TAN Polarised Capacitor; Value: 470uF
D6 = 1N5822 (THD): Diode Schottky 40V 3A Through Hole DO-201AD; PartNumber: 1N5822-E3/54
J1 = TB2 BLUE: CONN, TERMINAL BLOCK, 5.08mm pitch; VALUE: CONN_TB2
L1 L2 = Inductor SMD POWER 10X11mm: SMT Inductor
L3 = Ind 1206: SMT Inductor; Value: Ferrite
R8 = Resistor: Value: 100R
R24 R29 = Res 0805: SMT Resistor
  R24: VALUE: 39K
  R29: VALUE: 2K
U3 = MT3608 (SMD): Boost chip; PartNumber: MT3608
U4 = H-Link: Isolated 3W Power Module
U6 = LF33 (SMD): 500mA, Very Low Drop (0.45V) Voltage Regulator, 3.3V, 3-Pin DPAK, Tape and Reel; PartNumber: LF33CDT-TR; DatasheetVersion: Nov-2010; PackageVersion: 2011; PackageReference: TO-252; PackageDescription: 3-Pin Transistor Outline Package 2.28 mm Pitch, 9.7 mm Lead Span (DPAK); ComponentLink1Description: Manufacturer URL; ComponentLink1URL: http://www.st.com; ComponentLink2Description: Datasheet; ComponentLink2URL: http://www.st.com/internet/com/TECHNICAL_RESOURCES/TECHNICAL_LITERATURE/DATASHEET/CD00000546.pdf

## Sheet ICs.SchDoc
size A3
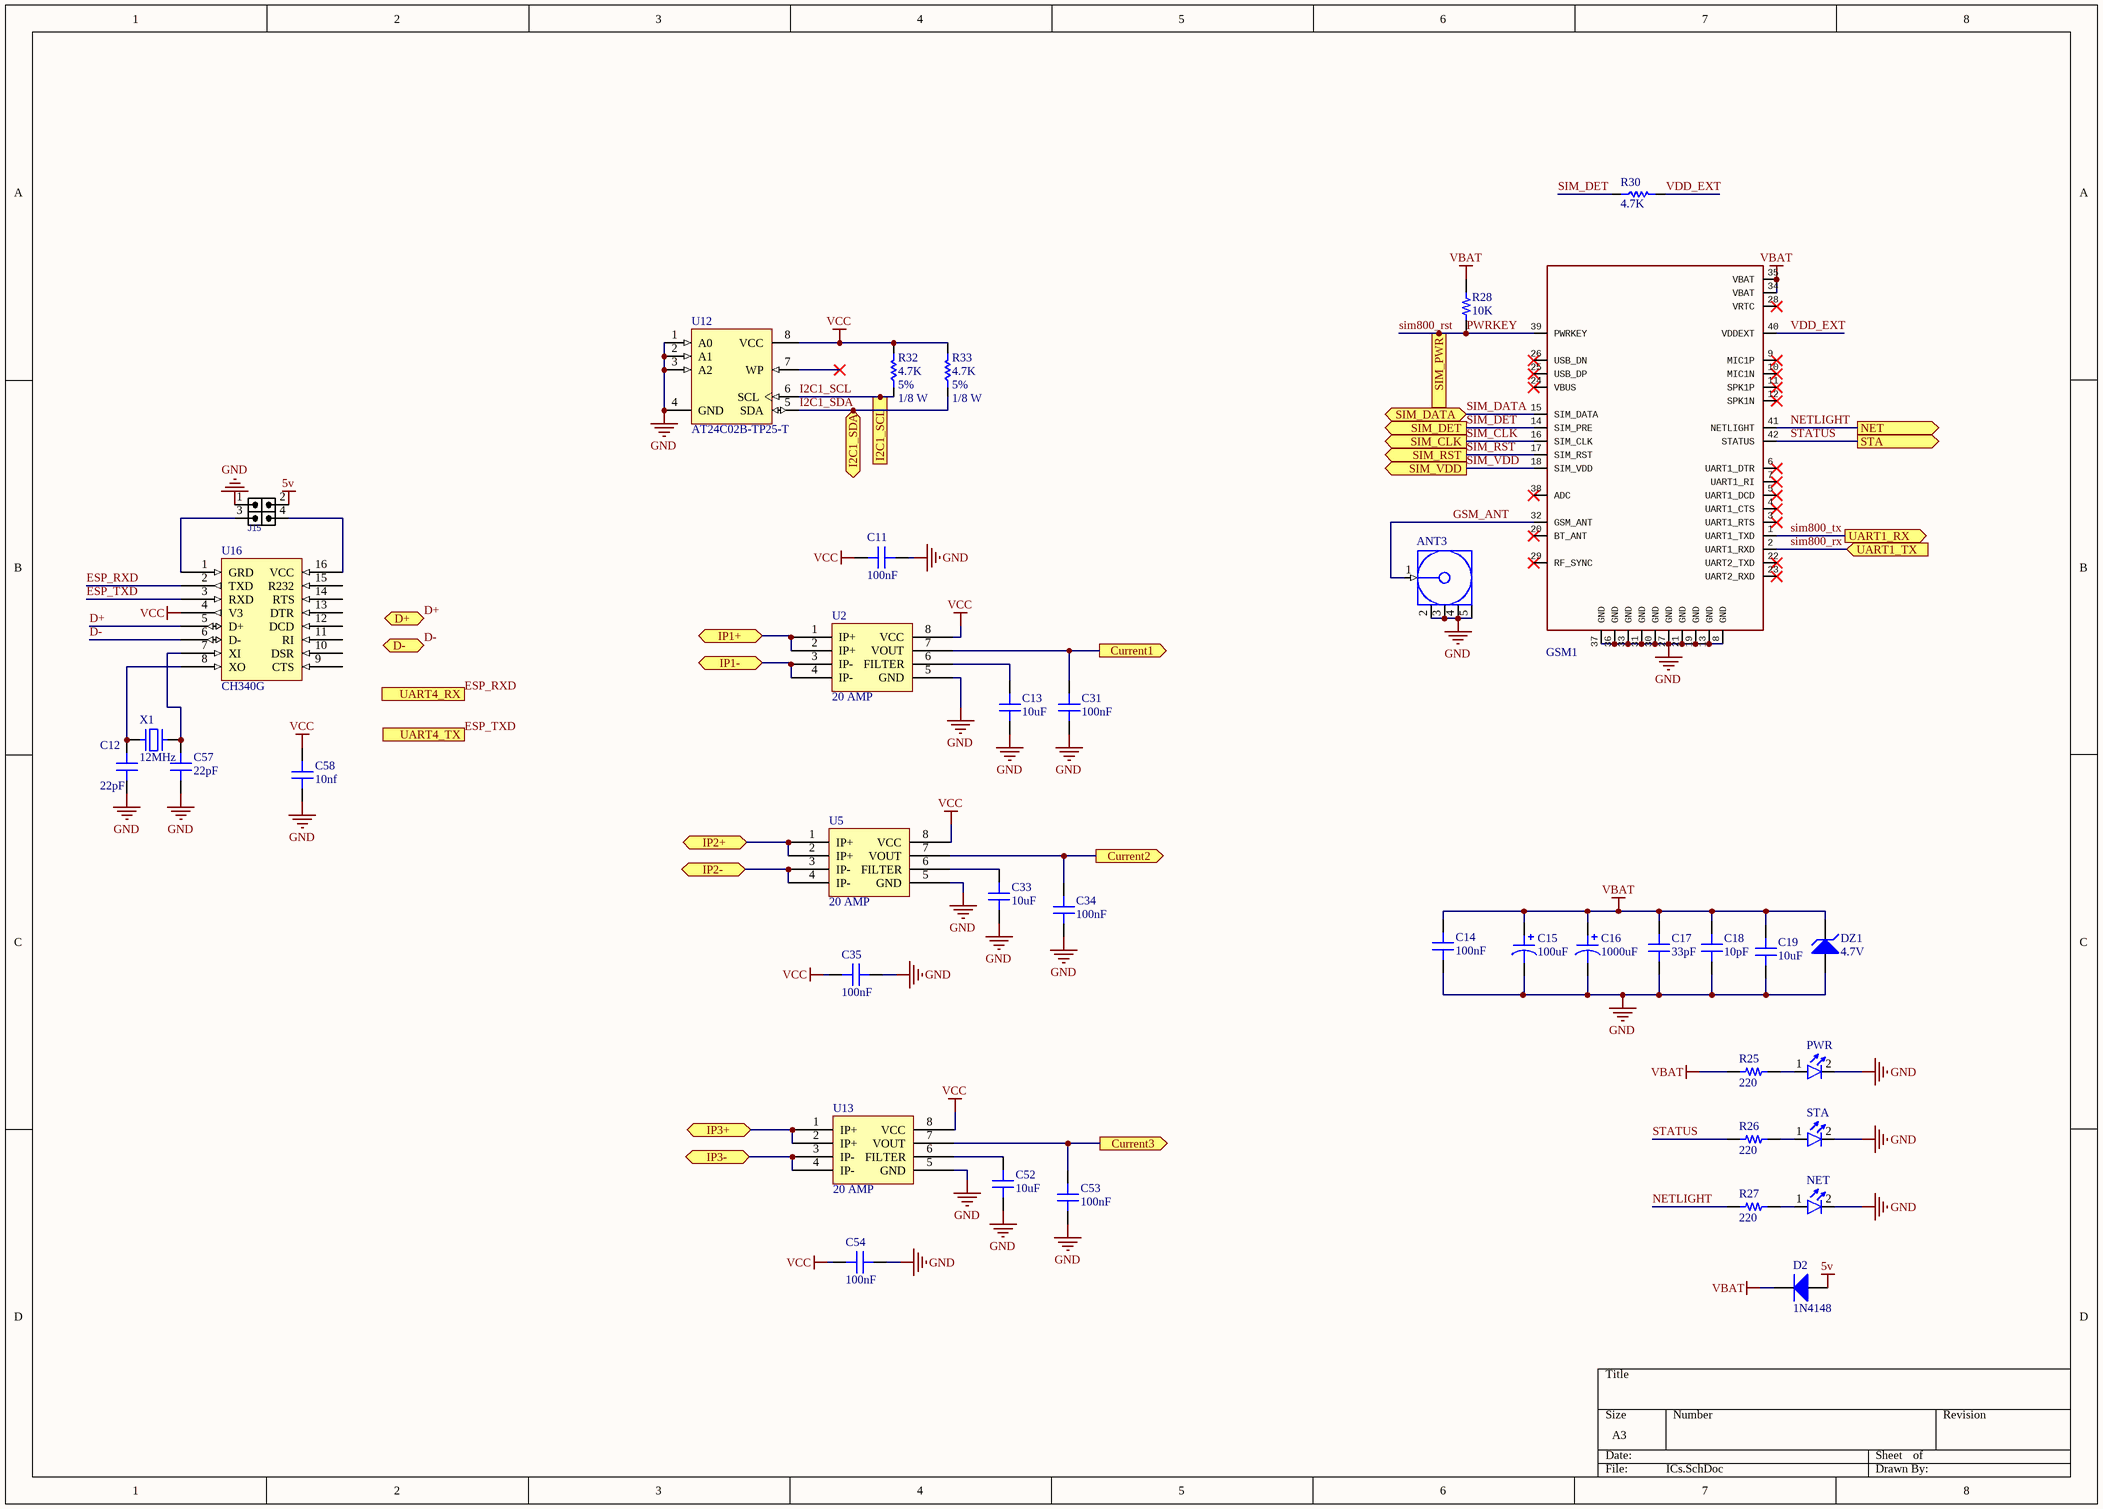
[diagram p5: ICs.SchDoc]

### Parts
ANT3  SMA  [SMA_RA]  (value not drawn)
C11  100nF  [CAP 0603_1608]
C12  22pF  [CAP 0805]
C13  10uF  [CAP 0805]
C14  100nF  [CAP 0805]
C15  100uF  [CAP TAN SMD 3528]
C16  1000uF  [CAP ALSMD POLY 8.3MM H8.0MM]
C17  33pF  [CAP 0805]
C18  10pF  [CAP 0805]
C19  10uF  [CAP 0805]
C31  100nF  [CAP 0603_1608]
C33  10uF  [CAP 0805]
C34  100nF  [CAP 0603_1608]
C35  100nF  [CAP 0603_1608]
C52  10uF  [CAP 0805_2012]
C53  100nF  [CAP 0603_1608]
C54  100nF  [CAP 0603_1608]
C57  22pF  [CAP 0805]
C58  10nf  [CAP 0805]
D2  Parameter 1: 1N4148  [DO-214AA SMB]  (hidden comment: 1N4148 SMD)
DZ1  value 4.7V  [SOD80]  (hidden comment: Zener 0.5W SMD)
GSM1  (no value)  [SIM800C_M]
J15  HDRM_2X2  [HDR_M_2X2]  (value not drawn)
NET  (no value)  [LED_0603_GREEN]
PWR  (no value)  [LED_0603_RED]
R25  220  [RES 0805]
R26  220  [RES 0805]
R27  220  [RES 0805]
R28  10K  [RES 0805]
R30  4.7K  [RES 0603_1608]
R32  Tolerance: 5%  Power: 1/8 W  [RES 0603_1608]  (hidden comment: 4.7K)
R33  Tolerance: 5%  Power: 1/8 W  [RES 0603_1608]  (hidden comment: 4.7K)
STA  (no value)  [LED_0603_BLUE]
U2  20 AMP  [SOIC_8pin]
U5  20 AMP  [SOIC_8pin]
U12  AT24C02B-TP25-T  [SO8_N]
U13  20 AMP  [SOIC_8]
U16  CH340G  [SOP16]
X1  Parameter 1: 12MHz  [XTAL THD HC49]

### Ports
Current1 (out), Current2 (out), Current3 (out), D+ (bidir), D- (bidir), I2C1_SCL (in), I2C1_SDA (bidir), IP1+ (bidir), IP1- (bidir), IP2+ (bidir), IP2- (bidir), IP3+ (bidir), IP3- (bidir), NET (out), SIM_CLK (out), SIM_DATA (bidir), SIM_DET (out), SIM_PWR (in), SIM_RST (out), SIM_VDD (out), STA (out), UART1_RX (out), UART1_TX (in), UART4_RX (out), UART4_TX (out)

### Nets
5v: D2.1(A) J15.2
GND: ANT3.2(GND) ANT3.3(GND) ANT3.4(GND) ANT3.5(GND) C11.1 C12.1 C13.1 C14.1 C15.2 C16.2 C17.1 C18.1 C19.1 C31.1 C33.1 C34.2 C35.1 C52.1 C53.2 C54.1 C57.1 C58.1 DZ1.1(A) GSM1.8(GND) GSM1.13(GND) GSM1.19(GND) GSM1.21(GND) GSM1.27(GND) GSM1.30(GND) GSM1.31(GND) GSM1.33(GND) GSM1.36(GND) GSM1.37(GND) J15.1 NET.2(K) PWR.2(K) STA.2(K) U2.5(GND) U5.5(GND) U12.1(A0) U12.2(A1) U12.3(A2) U12.4(GND) U13.5(GND)
VBAT: C14.2 C15.1 C16.1 C17.2 C18.2 C19.2 D2.2(K) DZ1.2(K) GSM1.34(VBAT) GSM1.35(VBAT) R25.2 R28.2
VCC: C11.2 C35.2 C54.2 C58.2 R32.2 R33.2 U2.8(VCC) U5.8(VCC) U12.8(VCC) U13.8(VCC) U16.4(V3)
CURRENT1: C31.2 U2.7(VOUT) ; port Current1
CURRENT2: C34.1 U5.7(VOUT) ; port Current2
CURRENT3: C53.1 U13.7(VOUT) ; port Current3
D+: U16.5(D+) ; port D+
D-: U16.6(D-) ; port D-
ESP_RXD: U16.2(TXD) ; port UART4_RX
ESP_TXD: U16.3(RXD) ; port UART4_TX
GSM_ANT: ANT3.1(Signal) GSM1.32(GSM_ANT)
I2C1_SCL: R32.1 U12.6(SCL) ; port I2C1_SCL
I2C1_SDA: R33.1 U12.5(SDA) ; port I2C1_SDA
NETLIGHT: GSM1.41(NETLIGHT) R27.2 ; port NET  [project net NET]
PWRKEY: GSM1.39(PWRKEY) R28.1 ; port SIM_PWR  [also labelled sim800_rst]
RL1_P+: U2.1(IP+) U2.2(IP+) ; port IP1+
RL1_P-: U2.3(IP-) U2.4(IP-) ; port IP1-
RL2_P+: U5.1(IP+) U5.2(IP+) ; port IP2+
RL2_P-: U5.3(IP-) U5.4(IP-) ; port IP2-
RL3_P+: U13.1(IP+) U13.2(IP+) ; port IP3+
RL3_P-: U13.3(IP-) U13.4(IP-) ; port IP3-
sim800_rx: GSM1.2(UART1_RXD) ; port UART1_TX
sim800_tx: GSM1.1(UART1_TXD) ; port UART1_RX
SIM_CLK: GSM1.16(SIM_CLK) ; port SIM_CLK
SIM_DATA: GSM1.15(SIM_DATA) ; port SIM_DATA
SIM_DET: GSM1.14(SIM_PRE) R30.1 ; port SIM_DET
SIM_RST: GSM1.17(SIM_RST) ; port SIM_RST
SIM_VDD: GSM1.18(SIM_VDD) ; port SIM_VDD
STATUS: GSM1.42(STATUS) R26.2 ; port STA  [project net STA]
VDD_EXT: GSM1.40(VDDEXT) R30.2
NetC12_2: C12.2 U16.8(XO) X1.1
NetC13_2: C13.2 U2.6(FILTER)
NetC33_2: C33.2 U5.6(FILTER)
NetC52_2: C52.2 U13.6(FILTER)
NetC57_2: C57.2 U16.7(XI) X1.2
NetJ15_3: J15.3 U16.1(GRD)
NetJ15_4: J15.4 U16.16(VCC)
NetNET_1: NET.1(A) R27.1
NetPWR_1: PWR.1(A) R25.1
NetR26_1: R26.1 STA.1(A)

Not connected (* = marked no-connect by the designer): GSM1 3(UART1_RTS)* 4(UART1_CTS)* 5(UART1_DCD)* 6(UART1_DTR)* 7(UART1_RI)* 9(MIC1P)* 10(MIC1N)* 11(SPK1P)* 12(SPK1N)* 20(BT_ANT)* 22(UART2_TXD)* 23(UART2_RXD)* 24(VBUS)* 25(USB_DP)* 26(USB_DN)* 28(VRTC)* 29(RF_SYNC)* 38(ADC)*; U12 7(WP)*; U16 9(CTS) 10(DSR) 11(RI) 12(DCD) 13(DTR) 14(RTS) 15(R232)

### Library data of the parts
ANT3 = SMA RA: RF Coaxial PCB Connector, MCX; Thru-Hole, Right-Angle Mount Socket, Blunt Post Terminal, 50 Ohm Impedance
C11-C14 C17-C19 C31 C33-C35 C52-C54 C57 C58 = Cap SMD 0805: SMT Capacitor
  C11 C14 C31 C34 C35 C53 C54: Value: 100nF
  C12 C57: Value: 22pF
  C13 C19 C33 C52: Value: 10uF
  C17: Value: 33pF
  C18: Value: 10pF
  C58: Value: 10nf
C15 = Pol Cap SMD TAN 3528 SIZE B: SMT TAN Polarised Capacitor; Value: 100uF
C16 = Pol Cap SMD AL D4 H4: SMT Polarised Capacitor; Value: 1000uF
D2 = 1N4148 SMD: Signal Diode
DZ1 = Zener 0.5W SMD: 0.5W Zener
GSM1 = SIM800C
J15 = HDR_M_2X2: CONN, HEADER, Male, pitch: 2.54mm, 4POS; MANF_P#: MANF_PART#; MANF: MANF; VALUE: HDRM_2X2
NET PWR STA = LED: as LED2 on sheet Relays; Adding Date: 1387/12/22
R25-R28 = Res SMD 0805: SMD Resistor
  R25-R27: Value: 220
  R28: Value: 10K
R30 R32 R33 = Resistor: Value: 4.7K
U2 U5 U13 = ACS712: Current Sensor
U12 = AT24C02B-TP25-T: 2Kbit (256 x 8), 2-wire Bus Automotive Serial EEPROM with full memory Write Protect, 2.5V, 8-Pin TSSOP, Tape & Reel; DatasheetVersion: 8517C,  Jan-2009; PackageVersion: revD, Dec-2009; PackageReference: 8A2; PackageDescription: 8-Lead, 4.4 mm Body, Plastic Thin Shrink Small Outline Package (TSSOP); Code_JEDEC: MO-153-AA; ComponentLink1Description: Manufacturer URL; ComponentLink1URL: http://www.atmel.com/; ComponentLink2Description: Datasheet; ComponentLink2URL: http://www.atmel.com/dyn/resources/prod_documents/doc8517.pdf
X1 = Crystal THD HC49: SMT Crystal

## Nets that join several sheets
5v: Power (8 pins), ICs (D2.1 J15.2)
12v: Relays (17 pins), Power (C36.2 F2.1)
GND: MCU (42 pins), Relays (29 pins), Connectors (17 pins), Power (11 pins), ICs (44 pins)
VCC: MCU (32 pins), Relays (U11.4), Connectors (J4.12 J4.13), Power (F3.2 R8.2), ICs (11 pins)
CURRENT1: MCU (U1.34), ICs (C31.2 U2.7)
CURRENT2: MCU (U1.35), ICs (C34.1 U5.7)
CURRENT3: MCU (U1.36), ICs (C53.1 U13.7)
D+: Connectors (PUSB1.3), ICs (U16.5)
D-: Connectors (PUSB1.2), ICs (U16.6)
ESP_RXD: MCU (U1.112), ICs (U16.2)
ESP_TXD: MCU (U1.111), ICs (U16.3)
I2C1_SCL: MCU (U1.136), ICs (R32.1 U12.6)
I2C1_SDA: MCU (U1.137), ICs (R33.1 U12.5)
L: Relays (J2.2 J3.2 J5.2), Power (J1.2 U4.1)
NET: MCU (U1.104), ICs (GSM1.41 R27.2)
P: Relays (6 pins), Power (J1.1 U4.2)
PWRKEY: MCU (U1.100), ICs (GSM1.39 R28.1)
Relay1: MCU (U1.114), Relays (C42.2 R11.1)
Relay2: MCU (U1.115), Relays (C43.2 R13.1)
Relay3: MCU (U1.116), Relays (C46.2 R6.1)
Relay4: MCU (U1.117), Relays (C47.2 R17.1)
RL1_P+: Relays (k1.NO1 k1.NO2), ICs (U2.1 U2.2)
RL1_P-: Relays (J2.1), ICs (U2.3 U2.4)
RL2_P+: Relays (k2.NO1 k2.NO2), ICs (U5.1 U5.2)
RL2_P-: Relays (J3.1), ICs (U5.3 U5.4)
RL3_P+: Relays (k3.NO1 k3.NO2), ICs (U13.1 U13.2)
RL3_P-: Relays (J5.1), ICs (U13.3 U13.4)
sim800_rx: MCU (U1.101), ICs (GSM1.2)
sim800_tx: MCU (U1.102), ICs (GSM1.1)
SIM_CLK: Connectors (J4.17), ICs (GSM1.16)
SIM_DATA: Connectors (J4.15), ICs (GSM1.15)
SIM_DET: Connectors (J4.19), ICs (GSM1.14 R30.1)
SIM_RST: Connectors (J4.21), ICs (GSM1.17)
SIM_VDD: Connectors (J4.23), ICs (GSM1.18)
STA: MCU (U1.103), ICs (GSM1.42 R26.2)
SW1: MCU (C60.2 R35.2 R36.2 U1.93), Connectors (J4.8)
SW2: MCU (C56.2 R31.2 R34.2 U1.99), Connectors (J4.10)
SW3: MCU (U1.79), Relays (LED6.1 R22.2)
SW_Light1: MCU (U1.87), Connectors (J4.2)
SW_Light2: MCU (U1.89), Connectors (J4.6)
SW_Light3: MCU (U1.88), Connectors (J4.4)